# Altium schematic sheet Peripherals.SchDoc
size A3; SheetNumber: 3; SheetTotal: 3
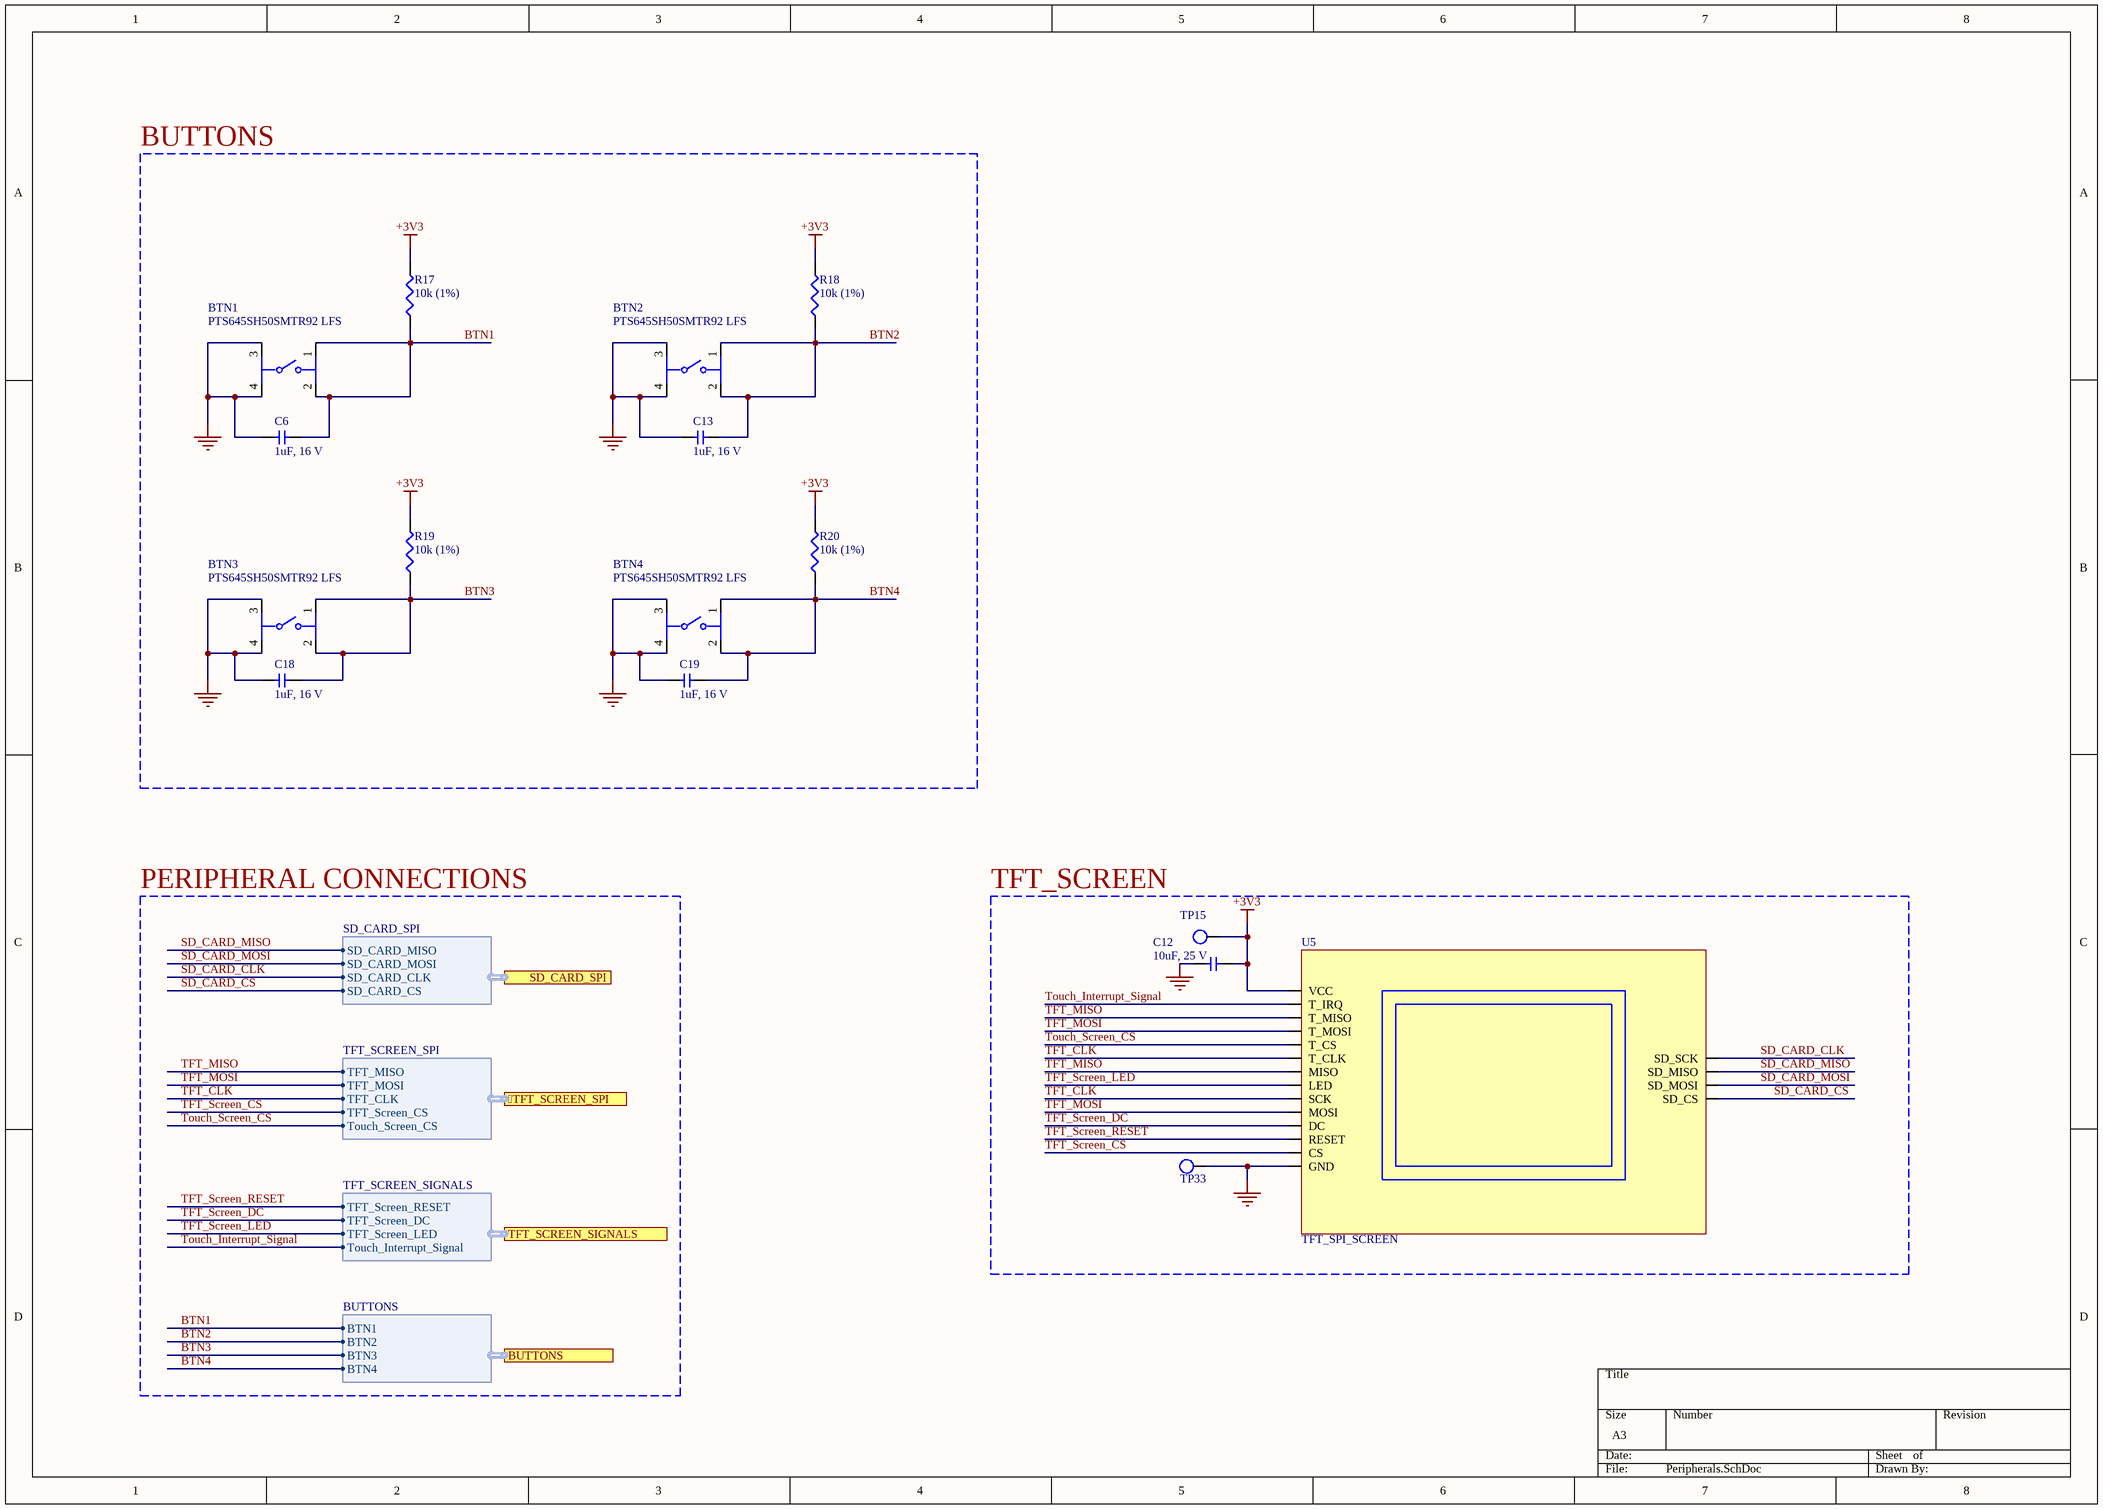
[diagram p0: Peripherals.SchDoc]

## Parts
BTN1  PTS645SH50SMTR92 LFS  [FP-PTS645SH50SMTR92LFS-MFG]
BTN2  PTS645SH50SMTR92 LFS  [FP-PTS645SH50SMTR92LFS-MFG]
BTN3  PTS645SH50SMTR92 LFS  [FP-PTS645SH50SMTR92LFS-MFG]
BTN4  PTS645SH50SMTR92 LFS  [FP-PTS645SH50SMTR92LFS-MFG]
C6  1uF, 16 V  [0805_CAP]
C12  10uF, 25 V  [0805_CAP]
C13  1uF, 16 V  [0805_CAP]
C18  1uF, 16 V  [0805_CAP]
C19  1uF, 16 V  [0805_CAP]
R17  10k (1%)  [0805_Resistor]
R18  10k (1%)  [0805_Resistor]
R19  10k (1%)  [0805_Resistor]
R20  10k (1%)  [0805_Resistor]
TP15  Test Point  [Probe-Point]  (value not drawn)
TP33  Test Point  [Probe-Point]  (value not drawn)
U5  TFT_SPI_SCREEN  [TFT_SCREEN]

## Blocks framed on the sheet
BUTTONS: BTN1-BTN4 C6 C13 C18 C19 R17-R20
TFT_SCREEN: C12 TP15 TP33 U5

## Ports
TFT_SCREEN_SPI (harness TFT_SCREEN_SPI, see DisplaySheet[3B], ESP32_MCU[5B]), BUTTONS (harness BUTTONS, see DisplaySheet[3C], ESP32_MCU[5C]), SD_CARD_SPI (harness SD_CARD_SPI, see DisplaySheet[3B], ESP32_MCU[5B]), TFT_SCREEN_SIGNALS (harness TFT_SCREEN_SIGNALS, see DisplaySheet[3C], ESP32_MCU[5C])

## Harnesses
SD_CARD_SPI: SD_CARD_MISO, SD_CARD_MOSI, SD_CARD_CLK, SD_CARD_CS
TFT_SCREEN_SPI: TFT_MISO, TFT_MOSI, TFT_CLK, TFT_Screen_CS, Touch_Screen_CS
TFT_SCREEN_SIGNALS: TFT_Screen_RESET, TFT_Screen_DC, TFT_Screen_LED, Touch_Interrupt_Signal
BUTTONS: BTN1, BTN2, BTN3, BTN4

## Nets
+3V3: C12.1 R17.2 R18.2 R19.2 R20.2 TP15.1 U5.1(VCC)
GND: BTN1.3 BTN1.4 BTN2.3 BTN2.4 BTN3.3 BTN3.4 BTN4.3 BTN4.4 C6.1 C12.2 C13.1 C18.1 C19.1 TP33.1 U5.2(GND)
BTN1: BTN1.1 BTN1.2 C6.2 R17.1 ; port BUTTONS.BTN1
BTN2: BTN2.1 BTN2.2 C13.2 R18.1 ; port BUTTONS.BTN2
BTN3: BTN3.1 BTN3.2 C18.2 R19.1 ; port BUTTONS.BTN3
BTN4: BTN4.1 BTN4.2 C19.2 R20.1 ; port BUTTONS.BTN4
SD_CARD_CLK: U5.18(SD_SCK) ; port SD_CARD_SPI.SD_CARD_CLK
SD_CARD_CS: U5.15(SD_CS) ; port SD_CARD_SPI.SD_CARD_CS
SD_CARD_MISO: U5.17(SD_MISO) ; port SD_CARD_SPI.SD_CARD_MISO
SD_CARD_MOSI: U5.16(SD_MOSI) ; port SD_CARD_SPI.SD_CARD_MOSI
TFT_CLK: U5.7(SCK) U5.10(T_CLK) ; port TFT_SCREEN_SPI.TFT_CLK
TFT_MISO: U5.9(MISO) U5.13(T_MISO) ; port TFT_SCREEN_SPI.TFT_MISO
TFT_MOSI: U5.6(MOSI) U5.12(T_MOSI) ; port TFT_SCREEN_SPI.TFT_MOSI
TFT_Screen_CS: U5.3(CS) ; port TFT_SCREEN_SPI.TFT_Screen_CS
TFT_Screen_DC: U5.5(DC) ; port TFT_SCREEN_SIGNALS.TFT_Screen_DC
TFT_Screen_LED: U5.8(LED) ; port TFT_SCREEN_SIGNALS.TFT_Screen_LED
TFT_Screen_RESET: U5.4(RESET) ; port TFT_SCREEN_SIGNALS.TFT_Screen_RESET
Touch_Interrupt_Signal: U5.14(T_IRQ) ; port TFT_SCREEN_SIGNALS.Touch_Interrupt_Signal
Touch_Screen_CS: U5.11(T_CS) ; port TFT_SCREEN_SPI.Touch_Screen_CS

## Notes on the sheet
- PERIPHERAL CONNECTIONS

## Library data of the parts
BTN1-BTN4 = PTS645SH50SMTR92 LFS: Tactile Switch SPST-NO Top Actuated Surface Mount; Manufacturer 1: ITT C&K; Manufacturer Part Number 1: PTS645SM43SMTR92LFS; Actuator Type: Pushbutton; Contact Current(DC)-Max: 50mA; Contact DC Max Rating R Load: 0.05A@12VDC; Contact Resistance: 0.1mR; Contact Voltage(DC)-Max: 12V; Dielectric Withstand Volts: 250VACV; Insulation Resistance: 100GR; PCB Hole Count: 4; Switch Action: MOMENTARY; Switch Function: SPST; Switch Type: Keypad; Body Breadth: 5.9944mm; Body Height: 3.4544mm; RoHS: Yes; Category: Tactile Switches; Stock 1: 178618; Pricing 1: 1=0.37, 10=0.299, 25=0.2756, 100=0.243, 250=0.22348, 500=0.2096 (USD); Mount: Surface Mount; Terminal Finish: Silver; Min Operating Temperature: -20°C; Max Operating Temperature: 60°C; JESD-609 Code: e4; Termination: Solder; Body Length or Diameter: 5.9944mm; Terminal Length: 0.138inch; Reach SVHC Compliant: Yes; RoHS Compliant: Yes; ComponentLink1URL: https://datasheet.ciiva.com:443/pdfs/VipMasterIC/IC/CKCI/CKCI-S-A0001796527/CKCI-S-A0001796842-1.pdf?src-supplier=IHS+Markit; ComponentLink1Description: https://datasheet.ciiva.com:443/pdfs/VipMasterIC/IC/CKCI/CKCI-S-A0001796527/CKCI-S-A0001796842-1.pdf?src-supplier=IHS+Markit; ComponentLink2URL: https://datasheet.ciiva.com/29903/getdatasheetpartid-786341-29903846.pdf?src-supplier=Verical; ComponentLink2Description: https://datasheet.ciiva.com/29903/getdatasheetpartid-786341-29903846.pdf?src-supplier=Verical; ComponentLink3URL: https://datasheet.ciiva.com/29931/getdatasheetpartid-764615-29931183.pdf?src-supplier=Verical; ComponentLink3Description: https://datasheet.ciiva.com/29931/getdatasheetpartid-764615-29931183.pdf?src-supplier=Verical; ComponentLink4URL: https://datasheet.ciiva.com/14920/pts645-14920733.pdf?src-supplier=Digikey; ComponentLink4Description: https://datasheet.ciiva.com/14920/pts645-14920733.pdf?src-supplier=Digikey; ComponentLink5URL: https://datasheet.ciiva.com/14920/pts645-14920734.pdf?src-supplier=Digikey; ComponentLink5Description: https://datasheet.ciiva.com/14920/pts645-14920734.pdf?src-supplier=Digikey; ComponentLink6URL: https://datasheet.ciiva.com/14920/pts645-14920735.pdf?src-supplier=Digikey; ComponentLink6Description: https://datasheet.ciiva.com/14920/pts645-14920735.pdf?src-supplier=Digikey; Supplier 1: Digikey; Supplier Part Number 1: CKN9085CT-ND
C6 C13 C18 C19 = CL31B105KOFNNNE: Ceramic Capacitor, Multilayer, Ceramic, 16V, 10% +Tol, 10% -Tol, X7R, 15% TC, 1uF, Surface Mount, 1206; Manufacturer 1: Samsung; Multilayer: Yes; Supplier 1: Digikey; Manufacturer Part Number 1: CL31B105KOFNNNE; RoHS: Yes; Category: Ceramic Capacitors; Stock 1: 16372; Pricing 1: 1=0.11, 10=0.059, 100=0.037, 1000=0.02531 (USD); Mount: Surface Mount; Number of Pins: 2; Dielectric Material: Ceramic; Package Shape: Rectangular; Size Code: 1206; Terminal Finish: Nickel; Min Operating Temperature: -55°C; Max Operating Temperature: 125°C; JESD-609 Code: e3; Capacitance: 1uF; Capacitor Type: Ceramic; Negative Tolerance: 10%; Package Style: SMTMeter; Packaging: Tape and Reel; Positive Tolerance: 10%; Rated DC Voltage (URdc): 16V; Temperature Characteristics Code: X7R; Termination: Wraparound; Length: 3.2mm; Width: 1.6mm; Height: 1.25mm; Reach SVHC Compliant: Yes; RoHS Compliant: Yes; ComponentLink1URL: https://datasheet.ciiva.com:443/pdfs/VipMasterIC/IC/SEMS/SEMS-S-A0008524868/SEMS-S-A0008524880-1.pdf?src-supplier=IHS+Markit; ComponentLink1Description: https://datasheet.ciiva.com:443/pdfs/VipMasterIC/IC/SEMS/SEMS-S-A0008524868/SEMS-S-A0008524880-1.pdf?src-supplier=IHS+Markit; ComponentLink2URL: https://datasheet.ciiva.com/25798/cl31b105kofnnne-25798673.pdf?src-supplier=Digikey; ComponentLink2Description: https://datasheet.ciiva.com/25798/cl31b105kofnnne-25798673.pdf?src-supplier=Digikey; ComponentLink3URL: https://datasheet.ciiva.com/26838/getdatasheetpartid-358370-26838906.pdf?src-supplier=Verical; ComponentLink3Description: https://datasheet.ciiva.com/26838/getdatasheetpartid-358370-26838906.pdf?src-supplier=Verical; ComponentLink4URL: https://datasheet.ciiva.com/29200/453334-da-01-en-vs-kondensator-1206-29200316.pdf?src-supplier=Conrad; ComponentLink4Description: https://datasheet.ciiva.com/29200/453334-da-01-en-vs-kondensator-1206-29200316.pdf?src-supplier=Conrad; ComponentLink5URL: https://datasheet.ciiva.com/26310/mlcc-catalogdownload2013-eng-26310089.pdf?src-supplier=Distrelec; ComponentLink5Description: https://datasheet.ciiva.com/26310/mlcc-catalogdownload2013-eng-26310089.pdf?src-supplier=Distrelec
C12 = TMK316BJ106KL-T: Ceramic Capacitor, Multilayer, Ceramic, 25V, 10% +Tol, 10% -Tol, X5R, 15% TC, 10uF, Surface Mount, 1206; Manufacturer: Taiyo Yuden; Multilayer: Yes; Supplier: Digikey; Supplier Part Number: 587-1337-1-ND; Manufacturer Part Number: TMK316BJ106KL-T; RoHS: Yes; Category: Ceramic Capacitors; Stock: 22102; Pricing: 1=0.12, 10=0.046, 100=0.04, 1000=0.03425 (USD); Mounting Technology: Surface Mount; Pins: 2; Dielectric Material: Ceramic; Package Shape: Rectangular; Case/Package: 1206; Terminal Finish: Nickel; Min Operating Temperature: -55°C; Max Operating Temperature: 85°C; JESD-609 Code: e3; Value: 10uF; Capacitor Type: Ceramic; Tolerance  (fill in as +-): 10%; Package Style: SMTMeter; Packaging: Tape and Reel; Tolerance (fill in as +-): 10%; Rated DC Voltage (URdc): 25V; Temperature Characteristics Code: X5R; Termination: Wraparound; Length: 3.2mm; Width: 1.6mm; Height: 1.6mm; Reach SVHC Compliant: Yes; RoHS Compliant: Yes; ComponentLink1URL: https://datasheet.ciiva.com:443/pdfs/VipMasterIC/IC/TAIY/TAIY-S-A0007939172/TAIY-S-A0007939042-1.pdf?src-supplier=IHS+Markit; ComponentLink1Description: https://datasheet.ciiva.com:443/pdfs/VipMasterIC/IC/TAIY/TAIY-S-A0007939172/TAIY-S-A0007939042-1.pdf?src-supplier=IHS+Markit; ComponentLink2URL: https://datasheet.ciiva.com/7975/1734574-7975841.pdf?src-supplier=Element14; ComponentLink2Description: https://datasheet.ciiva.com/7975/1734574-7975841.pdf?src-supplier=Element14; ComponentLink3URL: https://datasheet.ciiva.com/26936/getdatasheetpartid-782930-26936474.pdf?src-supplier=Verical; ComponentLink3Description: https://datasheet.ciiva.com/26936/getdatasheetpartid-782930-26936474.pdf?src-supplier=Verical; ComponentLink4URL: https://datasheet.ciiva.com/30053/584tmk316bj106kl-t-30053522.pdf?src-supplier=Onlinecomponents.com; ComponentLink4Description: https://datasheet.ciiva.com/30053/584tmk316bj106kl-t-30053522.pdf?src-supplier=Onlinecomponents.com; ComponentLink5URL: https://datasheet.ciiva.com/11601/tmk316bj106kl-t-ss-11601880.pdf?src-supplier=Avnet; ComponentLink5Description: https://datasheet.ciiva.com/11601/tmk316bj106kl-t-ss-11601880.pdf?src-supplier=Avnet; ComponentLink6URL: https://datasheet.ciiva.com/15922/1116tmk316bj106kl-t-15922414.pdf?src-supplier=Onlinecomponents.com; ComponentLink6Description: https://datasheet.ciiva.com/15922/1116tmk316bj106kl-t-15922414.pdf?src-supplier=Onlinecomponents.com; ComponentLink7URL: https://datasheet.ciiva.com/5420/mlcc-all-e-541559-5420143.pdf?src-supplier=Mouser; ComponentLink7Description: https://datasheet.ciiva.com/5420/mlcc-all-e-541559-5420143.pdf?src-supplier=Mouser
R17-R20 = RMCF0805FT10K0: Fixed Resistor, Metal Glaze/thick Film, 0.125W, 10000ohm, 150V, 1% +/-Tol, 100ppm/Cel, Surface Mount, 0805; Manufacturer 1: Stackpole Electronics; Rated Power Dissipation (P): 125mW; Rated Temperature: 70°C; Resistance: 10kR; Temperature Coefficient (ppm/Cel): 100; Package Height: 0.5mm; Package Length: 2mm; Package Width: 1.25mm; Reference Standard: AEC-Q200; Supplier 1: Digikey; Manufacturer Part Number 1: RMCF0805FT10K0; RoHS: Yes; Category: Chip SMD Resistors; Stock 1: 928178; Pricing 1: 1=0.1, 10=0.025, 100=0.012, 1000=0.00658, 2500=0.00564 (USD); Mount: Surface Mount; Number of Pins: 2; Package Shape: Rectangular; Size Code: 0805; Terminal Finish: Nickel; Min Operating Temperature: -55°C; Max Operating Temperature: 155°C; Tolerance: 1%; JESD-609 Code: e3; Resistor Type: FIXED RESISTOR; Construction: Rectangular; Packaging: Tape and Reel; Technology: METAL GLAZE/THICK FILM; Termination: Wraparound; Working Voltage: 150V; Reach SVHC Compliant: Yes; RoHS Compliant: Yes; ComponentLink1URL: https://datasheet.ciiva.com:443/pdfs/VipMasterIC/IC/SEIE/SEIE-S-A0009541969/SEIE-S-A0009541969-1.pdf?src-supplier=IHS+Markit; ComponentLink1Description: https://datasheet.ciiva.com:443/pdfs/VipMasterIC/IC/SEIE/SEIE-S-A0009541969/SEIE-S-A0009541969-1.pdf?src-supplier=IHS+Markit; ComponentLink2URL: https://datasheet.ciiva.com/15193/getdatasheetpartid-362046-15193525.pdf?src-supplier=Verical; ComponentLink2Description: https://datasheet.ciiva.com/15193/getdatasheetpartid-362046-15193525.pdf?src-supplier=Verical
TP15 TP33 = CMP-108-0001-3: Generic Test Point
U5 = TFT_SPI_SCREEN: 3.5inch SPI Module ILI9488 SKU:MSP3520